# Altium schematic sheet v1.1.SchDoc
size 157 x 63 mm
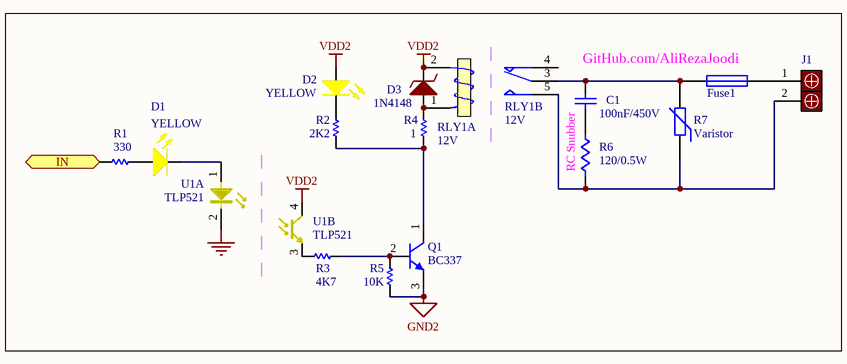
[diagram p0: v1.1.SchDoc]

## Parts
C1  100nF/450V  [C_THD_CER_(P2.54-D3.5-T1.5)]
D1  YELLOW  [LED_THD_3MM_YELLOW_R]
D2  YELLOW  [LED_THD_3MM_YELLOW_R]
D3  1N4148  [D_THD_AXIAL0.3_DO-35]
Fuse1  2A  [PIN-W2/E2.8]  (value not drawn)
J1  2PIN  [Connector_Phoenix_2PIN_MSTB]  (value not drawn)
Q1  BC337  [TO92C]
R1  330  [R_THD_AXIAL0.4(1/4W)]
R2  2K2  [R_THD_AXIAL0.4(1/4W)]
R3  4K7  [R_THD_AXIAL0.4(1/4W)]
R4  1  [R_THD_AXIAL0.4(1/4W)]
R5  10K  [R_THD_AXIAL0.4(1/4W)]
R6  120/0.5W  [R_THD_AXIAL0.4(1/4W)]
R7  Varistor  [R2012-0805]
RLY1  12V  [RELAY_SPDT_5PIN_2216]  (parts A,B of 2)
U1  TLP521  [DIP_4]  (parts A,B of 2)

## Ports
IN (in)

## Nets
GND: U1.2(K)
GND2: Q1.3(E) R5.2
VDD2: D2.1(A) D3.2 RLY1.2(T1) U1.4(C)
IN: R1.2 ; port IN
NetC1_1: C1.1 R6.2
NetC1_2: C1.2 Fuse1.1 R7.2 RLY1.3(COM)
NetD1_1: D1.1(A) R1.1
NetD1_2: D1.2(K) U1.1(A)
NetD2_2: D2.2(K) R2.2
NetD3_1: D3.1 R4.2 RLY1.1(T2)
NetFuse1_2: Fuse1.2 J1.1
NetJ1_2: J1.2 R6.1 R7.1 RLY1.5(NO)
NetQ1_1: Q1.1(C) R2.1 R4.1
NetQ1_2: Q1.2(B) R3.1 R5.1
NetR3_2: R3.2 U1.3(E)

Not connected (* = marked no-connect by the designer): RLY1 4(NC)

## Notes on the sheet
- (near Fuse1) GitHub.com/AliRezaJoodi
- RC Snubber

## Library data of the parts
C1 = Capacitor_Ceramic: Capacitor, Ceramic Multilayer; Revision: July-2002: Re-released for DXP Platform.
D1 D2 = LED_YELLOW: LED, Yellow; Manufacturer: Generic Components; Class I: Optoelectronic; Published: 8-Jun-2000; Revision: July-2002: Re-released for DXP Platform.; Publisher: Altium Limited; Class II: LED
D3 = Diode_Zener: Diode, Zener; Revision: July-2002: Re-released for DXP Platform.
Fuse1 = Fuse 1: Fuse; Manufacturer: Generic Components; Class I: Passive; Published: 8-Jun-2000; Revision: July-2002: Re-released for DXP Platform.; Publisher: Altium Limited; Class II: Fuse
J1 = Connector1x2_Power: Connector, Header, 2Pin; Revision: July-2002: Re-released for DXP Platform.
Q1 = NPN: NPN Bipolar Transistor; Manufacturer: Generic Components; Class I: Discrete; Class II: BJT - Low Power; Published: 8-Jun-2000; Revision: July-2002: Re-released for DXP Platform.; Publisher: Altium Limited
R1-R5 = Resistor: Revision: July-2002: Re-released for DXP Platform.
R6 = Resistor_3Form: Resistor; Revision: July-2002: Re-released for DXP Platform.
R7 = Res Varistor: Varistor (Voltage-Sensitive Resistor); Manufacturer: Generic Components; Class I: Discrete; Published: 24-Mar-1999; Revision: July-2002: Re-released for DXP Platform.; Publisher: Altium Limited; Class II: Voltage-Sensitive Resistor
RLY1 = Relay_SPDT_2Form: SPDT Relay
U1 = Optoisolator: Publisher: Altium Limited